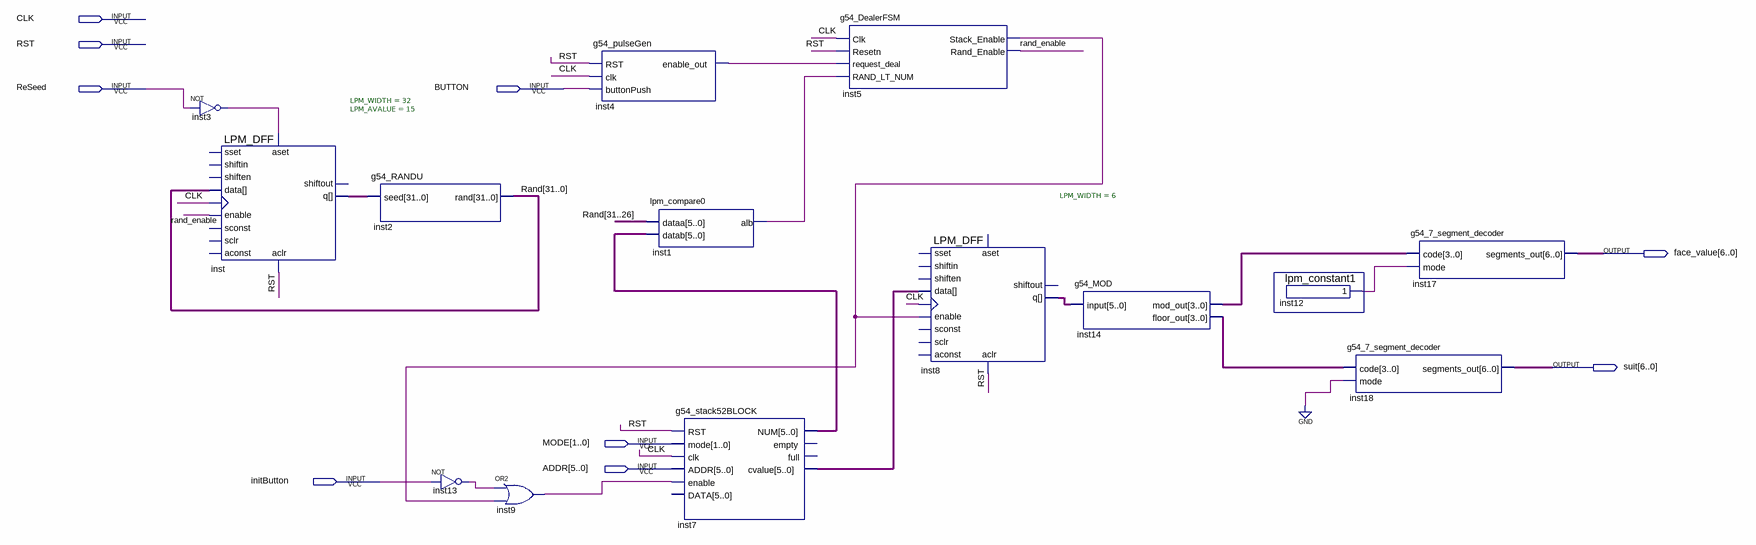
[diagram p0: schematic sheet]
// Quartus schematic Lab4_testbed2.bdf as structural Verilog: 14 symbols, 9 pins
module Lab4_testbed2 (
  input  CLK,
  input  RST,
  input  ReSeed,
  input  BUTTON,
  input  [1:0] MODE,
  input  [5:0] ADDR,
  input  initButton,
  output [6:0] face_value,
  output [6:0] suit
);

  wire inst1_alb, inst3_out, inst4_enable_out, inst5_stack_enable, inst9_out, inst12_result, inst13_out,
       rand_enable;
  wire [3:0] inst14_floor_out, inst14_mod_out;
  wire [5:0] inst7_cvalue, inst7_num, inst8_q;
  wire [31:0] inst_q, Rand;

  not inst3 (inst3_out, ReSeed);
  LPM_DFF #(.LPM_WIDTH(32), .LPM_AVALUE(15)) inst (
    .enable(rand_enable), .clock(CLK), .data(Rand), .aset(inst3_out), .aclr(RST), .q(inst_q));  // open: shiftin, shiften, aconst, sclr, sconst, sset, shiftout
  g54_RANDU inst2 (.seed(inst_q), .\rand (Rand));
  not inst13 (inst13_out, initButton);
  or inst9 (inst9_out, inst13_out, inst5_stack_enable);
  g54_pulseGen inst4 (.RST(RST), .clk(CLK), .buttonPush(BUTTON), .enable_out(inst4_enable_out));
  lpm_compare0 inst1 (.dataa(Rand[31:26]), .datab(inst7_num), .alb(inst1_alb));
  g54_stack52BLOCK inst7 (
    .RST(RST), .mode(MODE), .clk(CLK), .ADDR(ADDR), .enable(inst9_out), .NUM(inst7_num), .cvalue(inst7_cvalue));  // open: DATA, empty, full
  g54_DealerFSM inst5 (
    .Clk(CLK), .Resetn(RST), .request_deal(inst4_enable_out), .RAND_LT_NUM(inst1_alb),
    .Stack_Enable(inst5_stack_enable), .Rand_Enable(rand_enable));
  LPM_DFF #(.LPM_WIDTH(6)) inst8 (
    .enable(inst5_stack_enable), .clock(CLK), .data(inst7_cvalue), .aclr(RST), .q(inst8_q));  // open: shiftin, shiften, aconst, sclr, sconst, sset, aset, shiftout
  g54_MOD inst14 (.\input (inst8_q), .mod_out(inst14_mod_out), .floor_out(inst14_floor_out));
  lpm_constant1 inst12 (.result(inst12_result));
  g54_7_segment_decoder inst18 (.code(inst14_floor_out), .mode(1'b0), .segments_out(suit));
  g54_7_segment_decoder inst17 (.code(inst14_mod_out), .mode(inst12_result), .segments_out(face_value));
endmodule
